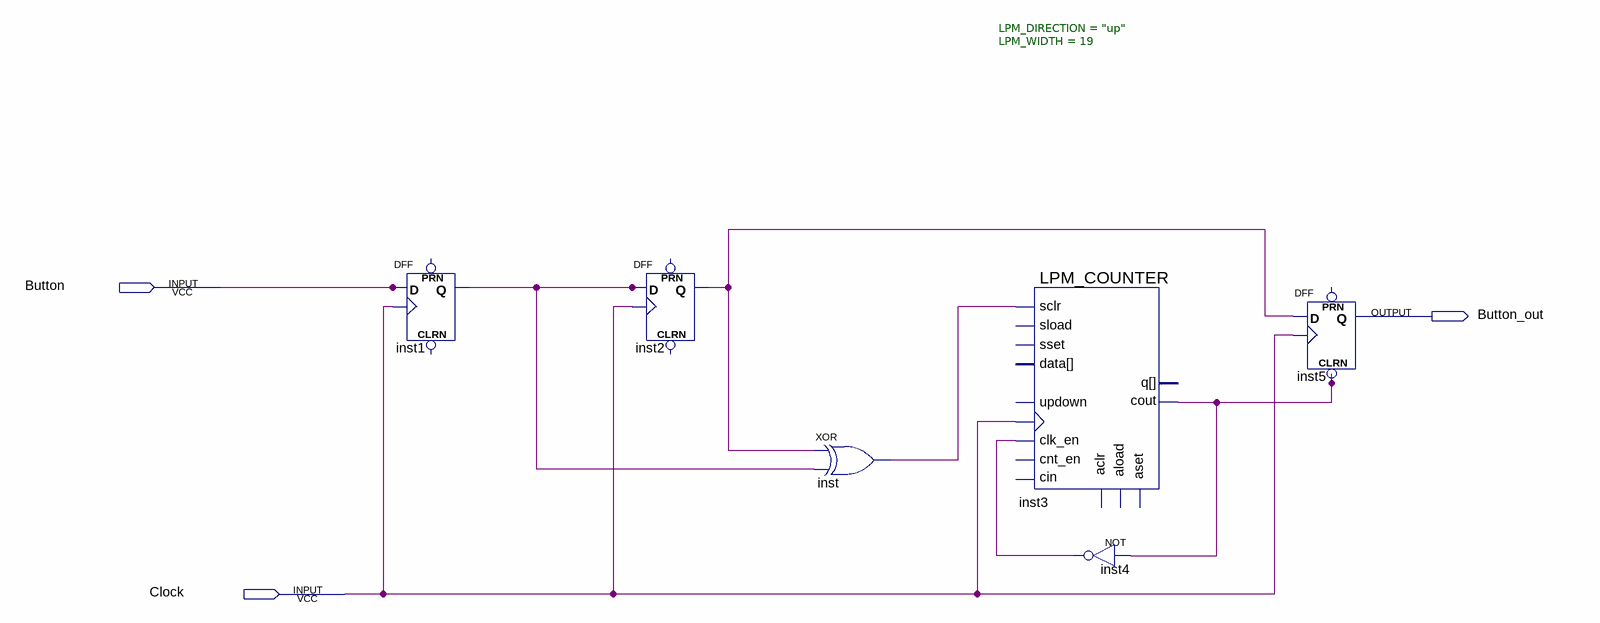
[diagram p0: schematic sheet]
// Quartus schematic Debouncer.bdf as structural Verilog: 6 symbols, 3 pins
module Debouncer (
  input  Button,
  input  Clock,
  output Button_out
);

  wire inst1_q, inst2_q, inst3_cout, inst4_out, inst_out;

  DFF inst1 (.CLK(Clock), .D(Button), .Q(inst1_q));  // open: CLRN, PRN
  DFF inst2 (.CLK(Clock), .D(inst1_q), .Q(inst2_q));  // open: CLRN, PRN
  xor inst (inst_out, inst2_q, inst1_q);
  LPM_COUNTER #(.LPM_DIRECTION("up"), .LPM_WIDTH(19)) inst3 (
    .clock(Clock), .clk_en(inst4_out), .sclr(inst_out), .cout(inst3_cout));  // open: sload, data, aload, aclr, aset, cin, sset, updown, cnt_en, q
  not inst4 (inst4_out, inst3_cout);
  DFF inst5 (.CLRN(inst3_cout), .CLK(Clock), .D(inst2_q), .Q(Button_out));  // open: PRN
endmodule
